# EAGLE schematic Relay_Board_V3 (EAGLE 8.4.0)

## Sheet 1 of 2
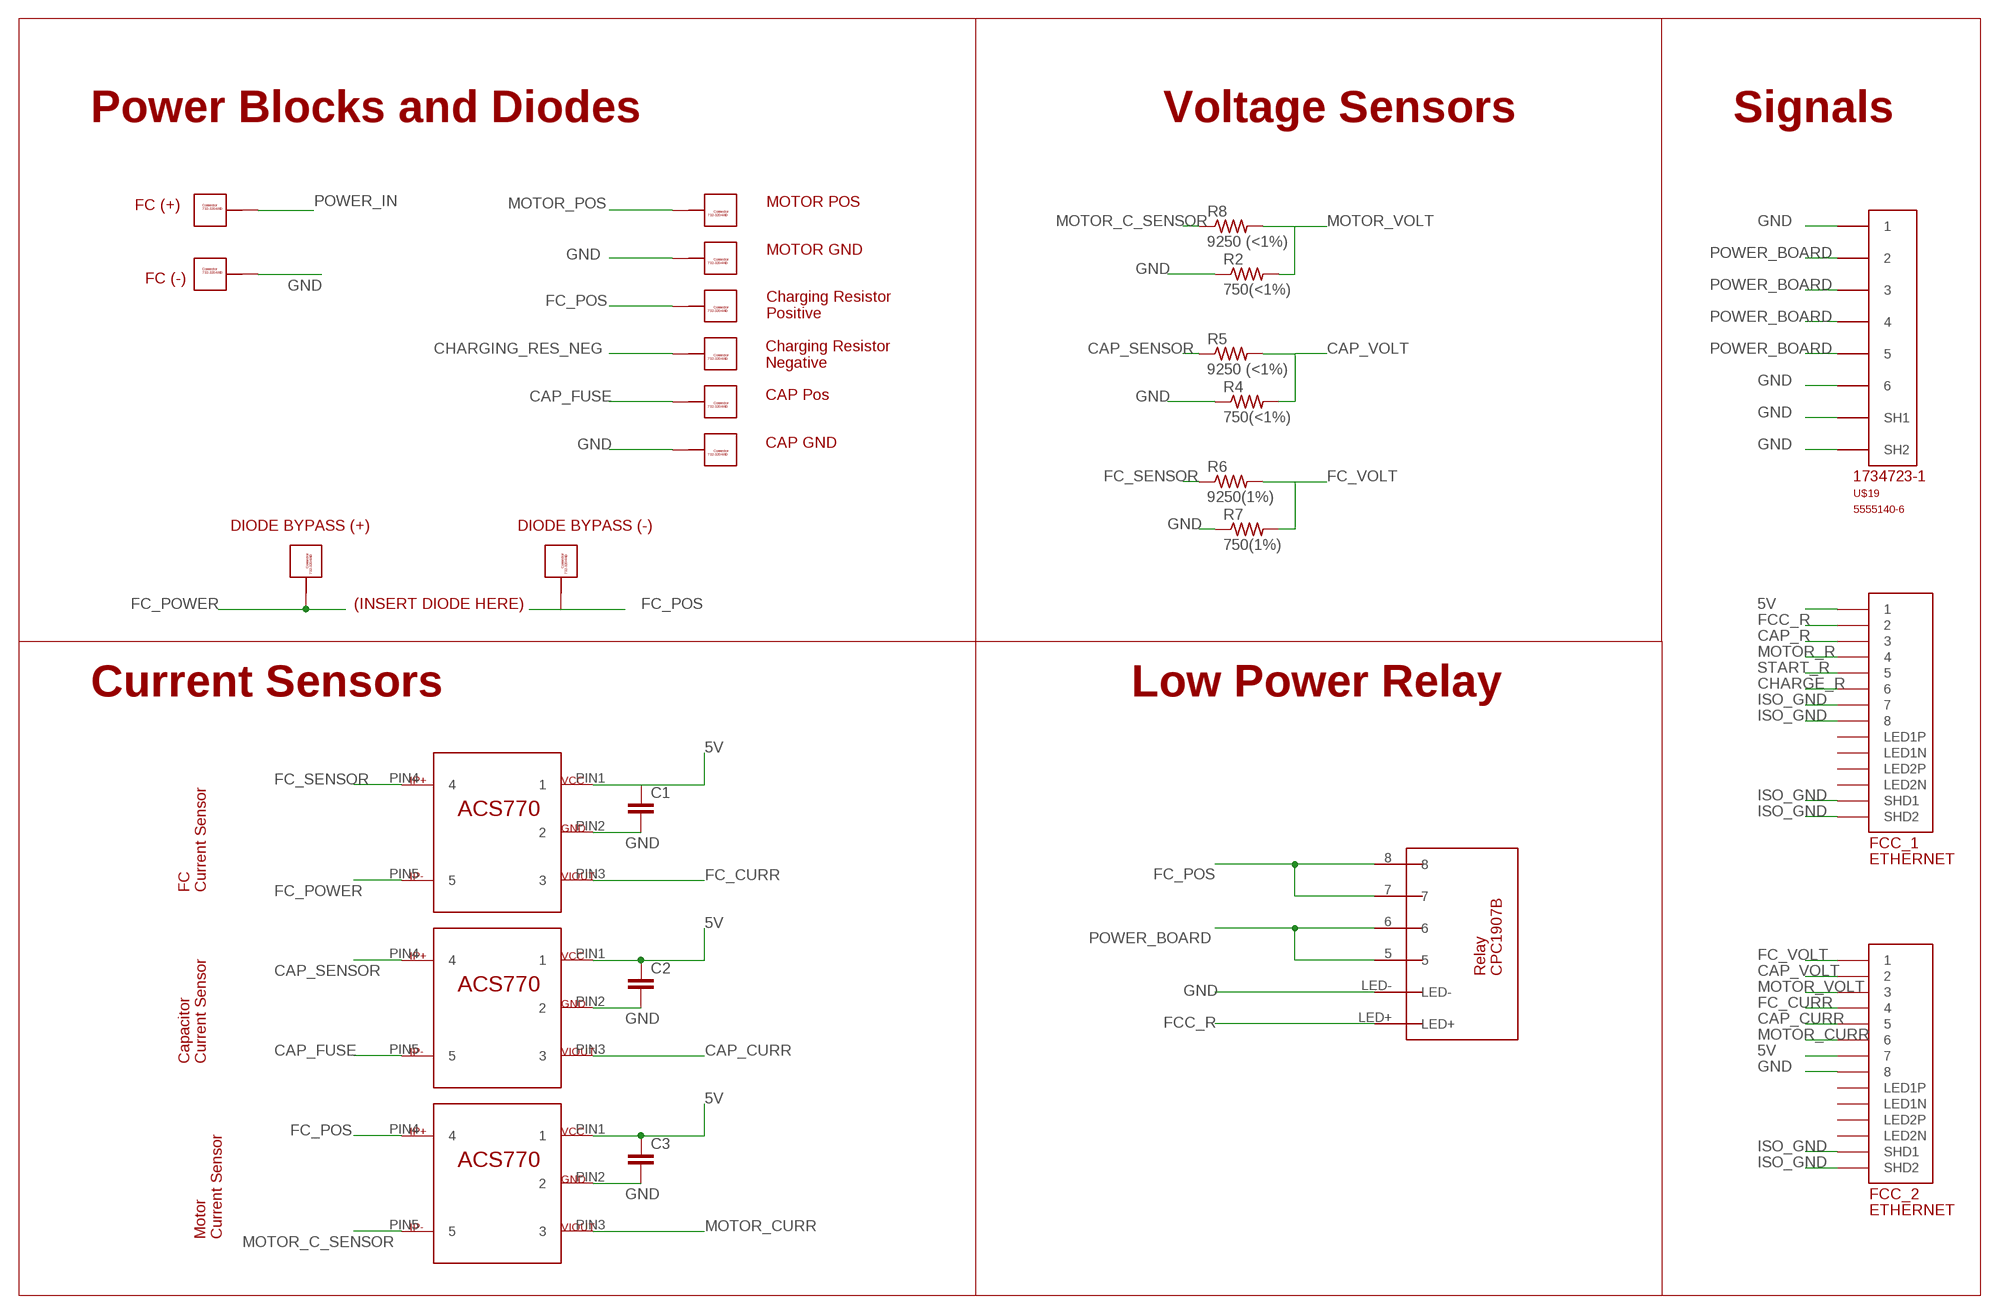
[diagram p0: schematic, sheet 1]

### Parts
C1  CAP0603-CAP  [0603-CAP]
C2  CAP0603-CAP  [0603-CAP]
C3  CAP0603-CAP  [0603-CAP]
CAP.GND  732-3204-ND_CONNECTOR  [732-3204-ND]
CAP.GND1  732-3204-ND_CONNECTOR  [732-3204-ND]
CAP.POS1  732-3204-ND_CONNECTOR  [732-3204-ND]
CAP.POS2  732-3204-ND_CONNECTOR  [732-3204-ND]
FC.GND  732-3204-ND_CONNECTOR  [732-3204-ND]
FC.POS  732-3204-ND_CONNECTOR  [732-3204-ND]
FCC_1  ETHERNET  [A122645-ND]
FCC_2  ETHERNET  [A122645-ND]
MOTOR.GROUND  732-3204-ND_CONNECTOR  [732-3204-ND]
MOTOR.POSITIVE  732-3204-ND_CONNECTOR  [732-3204-ND]
R2  750(<1%)  R-US_R0805  [R0805]
R4  750(<1%)  R-US_R0805  [R0805]
R5  9250 (<1%)  R-US_R0805  [R0805]
R6  9250(1%)  R-US_R0805  [R0805]
R7  750(1%)  R-US_R0805  [R0805]
R8  9250 (<1%)  R-US_R0805  [R0805]
RES.NEG  732-3204-ND_CONNECTOR  [732-3204-ND]
RES.POS  732-3204-ND_CONNECTOR  [732-3204-ND]
U$7  ACS770LCB_CURRENTSENSOR  [ACS770LCB_CURRENTSENSOR]
U$8  ACS770LCB_CURRENTSENSOR  [ACS770LCB_CURRENTSENSOR]
U$9  ACS770LCB_CURRENTSENSOR  [ACS770LCB_CURRENTSENSOR]
U$19  5555140-6  [1734723-1_RJ11]
U$22  RELAY-CPC1907B  [RELAY-CPC1907B]

### Nets
5V: C1.1 C2.1 C3.1 FCC_1.P$1 FCC_2.P$7 U$7.PIN1 U$8.PIN1 U$9.PIN1
CAP_CURR: FCC_2.P$5 U$8.PIN3
CAP_FUSE: CAP.GND1.P$1 CAP.GND1.P$2 CAP.GND1.P$3 CAP.GND1.P$4 CAP.GND1.P$5 CAP.GND1.P$6 CAP.GND1.P$7 CAP.GND1.P$8 CAP.GND1.P$9 CAP.GND1.P$10 U$8.PIN5 ; also sheet 2
CAP_R: FCC_1.P$3 ; also sheet 2
CAP_SENSOR: R5.1 U$8.PIN4
CAP_VOLT: FCC_2.P$2 R4.2 R5.2
CHARGE_R: FCC_1.P$6 ; also sheet 2
CHARGING_RES_NEG: RES.NEG.P$1 RES.NEG.P$2 RES.NEG.P$3 RES.NEG.P$4 RES.NEG.P$5 RES.NEG.P$6 RES.NEG.P$7 RES.NEG.P$8 RES.NEG.P$9 RES.NEG.P$10 ; also sheet 2
FC_CURR: FCC_2.P$4 U$7.PIN3
FC_POS: CAP.POS2.P$1 CAP.POS2.P$2 CAP.POS2.P$3 CAP.POS2.P$4 CAP.POS2.P$5 CAP.POS2.P$6 CAP.POS2.P$7 CAP.POS2.P$8 CAP.POS2.P$9 CAP.POS2.P$10 RES.POS.P$1 RES.POS.P$2 RES.POS.P$3 RES.POS.P$4 RES.POS.P$5 RES.POS.P$6 RES.POS.P$7 RES.POS.P$8 RES.POS.P$9 RES.POS.P$10 U$9.PIN4 U$22.7 U$22.8 ; also sheet 2
FC_POWER: CAP.POS1.P$1 CAP.POS1.P$2 CAP.POS1.P$3 CAP.POS1.P$4 CAP.POS1.P$5 CAP.POS1.P$6 CAP.POS1.P$7 CAP.POS1.P$8 CAP.POS1.P$9 CAP.POS1.P$10 U$7.PIN5
FC_SENSOR: R6.1 U$7.PIN4
FC_VOLT: FCC_2.P$1 R6.2 R7.2
FCC_R: FCC_1.P$2 U$22.LED+
GND: C1.2 C2.2 C3.2 CAP.GND.P$1 CAP.GND.P$2 CAP.GND.P$3 CAP.GND.P$4 CAP.GND.P$5 CAP.GND.P$6 CAP.GND.P$7 CAP.GND.P$8 CAP.GND.P$9 CAP.GND.P$10 FC.GND.P$1 FC.GND.P$2 FC.GND.P$3 FC.GND.P$4 FC.GND.P$5 FC.GND.P$6 FC.GND.P$7 FC.GND.P$8 FC.GND.P$9 FC.GND.P$10 FCC_2.P$8 MOTOR.GROUND.P$1 MOTOR.GROUND.P$2 MOTOR.GROUND.P$3 MOTOR.GROUND.P$4 MOTOR.GROUND.P$5 MOTOR.GROUND.P$6 MOTOR.GROUND.P$7 MOTOR.GROUND.P$8 MOTOR.GROUND.P$9 MOTOR.GROUND.P$10 R2.1 R4.1 R7.1 U$7.PIN2 U$8.PIN2 U$9.PIN2 U$19.1 U$19.6 U$19.SH1 U$19.SH2 U$22.LED- ; also sheet 2
ISO_GND: FCC_1.P$7 FCC_1.P$8 FCC_1.P$13(SHD1) FCC_1.P$14(SHD2) FCC_2.P$13(SHD1) FCC_2.P$14(SHD2) ; also sheet 2
MOTOR_C_SENSOR: R8.1 U$9.PIN5 ; also sheet 2
MOTOR_CURR: FCC_2.P$6 U$9.PIN3
MOTOR_POS: MOTOR.POSITIVE.P$1 MOTOR.POSITIVE.P$2 MOTOR.POSITIVE.P$3 MOTOR.POSITIVE.P$4 MOTOR.POSITIVE.P$5 MOTOR.POSITIVE.P$6 MOTOR.POSITIVE.P$7 MOTOR.POSITIVE.P$8 MOTOR.POSITIVE.P$9 MOTOR.POSITIVE.P$10 ; also sheet 2
MOTOR_R: FCC_1.P$4 ; also sheet 2
MOTOR_VOLT: FCC_2.P$3 R2.2 R8.2
POWER_BOARD: U$19.2 U$19.3 U$19.4 U$19.5 U$22.5 U$22.6
POWER_IN: FC.POS.P$1 FC.POS.P$2 FC.POS.P$3 FC.POS.P$4 FC.POS.P$5 FC.POS.P$6 FC.POS.P$7 FC.POS.P$8 FC.POS.P$9 FC.POS.P$10
START_R: FCC_1.P$5 ; also sheet 2
Unconnected: FCC_1.P$9(LED1N) FCC_1.P$10(LED1P) FCC_1.P$11(LED2N) FCC_1.P$12(LED2P) FCC_2.P$9(LED1N) FCC_2.P$10(LED1P) FCC_2.P$11(LED2N) FCC_2.P$12(LED2P)

### Notes on the sheet
- Power Blocks and Diodes | Voltage Sensors | Signals
- FC (+) | MOTOR POS
- MOTOR GND
- FC (-)
- Charging Resistor
  Positive
- Charging Resistor
  Negative
- CAP Pos
- CAP GND
- DIODE BYPASS (+) | DIODE BYPASS (-)
- (INSERT DIODE HERE)
- Current Sensors | Low Power Relay
- FC
  Current Sensor
- Capacitor
  Current Sensor
- Motor
  Current Sensor

## Sheet 2 of 2
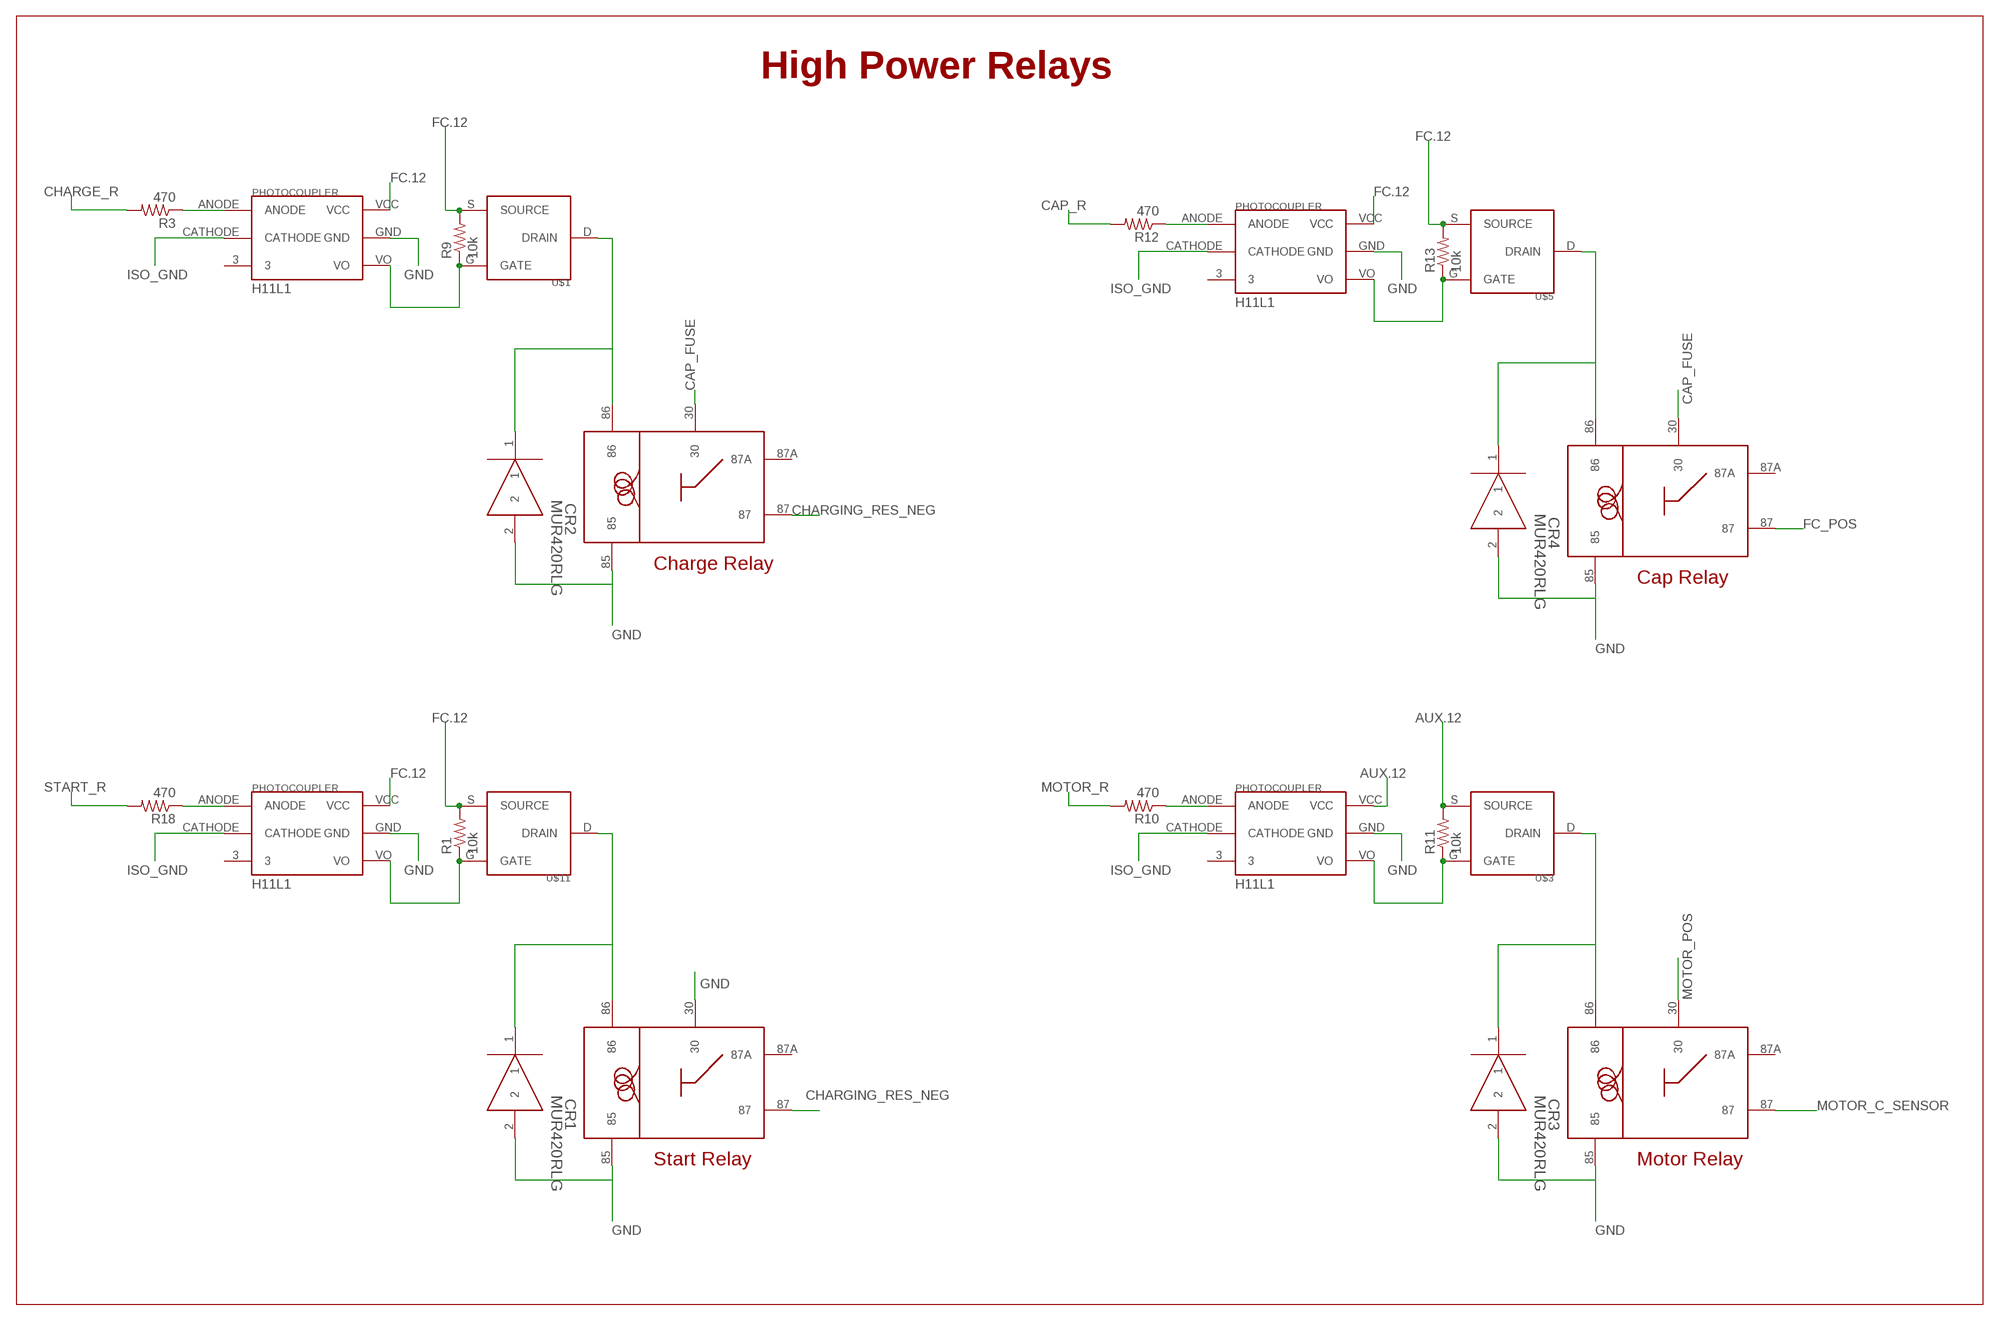
[diagram p1: schematic, sheet 2]

### Parts
CR1  MUR420RLG  [DO-201AD]
CR2  MUR420RLG  [DO-201AD]
CR3  MUR420RLG  [DO-201AD]
CR4  MUR420RLG  [DO-201AD]
R1  10k  RESISTOR0603-RES  [0603-RES]
R3  470  RESISTOR0603-RES  [0603-RES]
R9  10k  RESISTOR0603-RES  [0603-RES]
R10  470  RESISTOR0603-RES  [0603-RES]
R11  10k  RESISTOR0603-RES  [0603-RES]
R12  470  RESISTOR0603-RES  [0603-RES]
R13  10k  RESISTOR0603-RES  [0603-RES]
R18  470  RESISTOR0603-RES  [0603-RES]
START.RELAY1  VCF4-1000  [VCF4-1000]
START.RELAY2  VCF4-1000  [VCF4-1000]
START.RELAY3  VCF4-1000  [VCF4-1000]
START.RELAY4  VCF4-1000  [VCF4-1000]
U$1  DMP3056L-7DMP3056L-7  [DMP3056L-7]
U$2  H11L1H11L1  [H11L1]
U$3  DMP3056L-7DMP3056L-7  [DMP3056L-7]
U$4  H11L1H11L1  [H11L1]
U$5  DMP3056L-7DMP3056L-7  [DMP3056L-7]
U$6  H11L1H11L1  [H11L1]
U$11  DMP3056L-7DMP3056L-7  [DMP3056L-7]
U$12  H11L1H11L1  [H11L1]

### Nets
AUX.12: R11.2 U$3.S(SOURCE) U$4.VCC
CAP_FUSE: START.RELAY2.30 START.RELAY4.30 ; also sheet 1
CAP_R: R12.2 ; also sheet 1
CHARGE_R: R3.2 ; also sheet 1
CHARGING_RES_NEG: START.RELAY1.87 START.RELAY2.87 ; also sheet 1
FC.12: R1.2 R9.2 R13.2 U$1.S(SOURCE) U$2.VCC U$5.S(SOURCE) U$6.VCC U$11.S(SOURCE) U$12.VCC
FC_POS: START.RELAY4.87 ; also sheet 1
GND: CR1.2 CR2.2 CR3.2 CR4.2 START.RELAY1.30 START.RELAY1.85 START.RELAY2.85 START.RELAY3.85 START.RELAY4.85 U$2.GND U$4.GND U$6.GND U$12.GND ; also sheet 1
ISO_GND: U$2.CATHODE U$4.CATHODE U$6.CATHODE U$12.CATHODE ; also sheet 1
MOTOR_C_SENSOR: START.RELAY3.87 ; also sheet 1
MOTOR_POS: START.RELAY3.30 ; also sheet 1
MOTOR_R: R10.2 ; also sheet 1
N$1: R9.1 U$1.G(GATE) U$2.VO
N$2: R3.1 U$2.ANODE
N$3: CR2.1 START.RELAY2.86 U$1.D(DRAIN)
N$4: R11.1 U$3.G(GATE) U$4.VO
N$5: R10.1 U$4.ANODE
N$6: CR3.1 START.RELAY3.86 U$3.D(DRAIN)
N$7: R13.1 U$5.G(GATE) U$6.VO
N$8: R12.1 U$6.ANODE
N$13: CR4.1 START.RELAY4.86 U$5.D(DRAIN)
N$21: R1.1 U$11.G(GATE) U$12.VO
N$23: R18.1 U$12.ANODE
N$30: CR1.1 START.RELAY1.86 U$11.D(DRAIN)
START_R: R18.2 ; also sheet 1
Unconnected: START.RELAY1.87A START.RELAY2.87A START.RELAY3.87A START.RELAY4.87A U$2.3 U$4.3 U$6.3 U$12.3

### Notes on the sheet
- High Power Relays
- Charge Relay
- Cap Relay
- Start Relay | Motor Relay

## Library data of the parts
C1-C3 = SparkFun-Passives:CAP: Capacitor Standard 0603 ceramic capacitor, and 0.1" leaded capacitor.
CAP.GND CAP.GND1 CAP.POS1 CAP.POS2 FC.GND FC.POS MOTOR.GROUND MOTOR.POSITIVE RES.NEG RES.POS = Connector 732-3204:732-3204-ND_CONNECTOR
CR1-CR4 = MUR420RLG - Diode:MUR420RLG; MANUFACTURER_PART_NUMBER: MUR420RLG; VENDOR: ON Semiconductor
FCC_1 FCC_2 = ETHERNET-3:ETHERNET: Ethernet port with 2 leds. digikey number A122645-ND
R1 R3 R9-R13 R18 = SparkFun:RESISTOR: Resistor Basic schematic elements and footprints for 0603, 1206, and PTH resistors.
R2 R4-R8 = resistor:R-US_: RESISTOR, American symbol
START.RELAY1-START.RELAY4 = VCF4-1000:VCF4-1000: Part for the VCF4-1000 relay socket. Digi-Key Part Number: PB232-ND. Pin numbering is directly taken from the data sheet of the relay. Relay Digi-Key Part Number: 255-2083-ND (Also works with 255-1825-ND). If using relay 255-1825-ND, ignore pin 87A.
U$1 U$3 U$5 U$11 = DMP3056L-7:DMP3056L-7
U$2 U$4 U$6 U$12 = FCC_parts:H11L1
U$7-U$9 = ACS770 Current Sensor:ACS770LCB_CURRENTSENSOR
U$19 = 5555140-6 RJ11:5555140-6
U$22 = Relay_CPC1907B:RELAY-CPC1907B